# Altium schematic sheet pwir21-NUCLEO-adapter.SchDoc
size A4; SheetNumber: 1; SheetTotal: 1
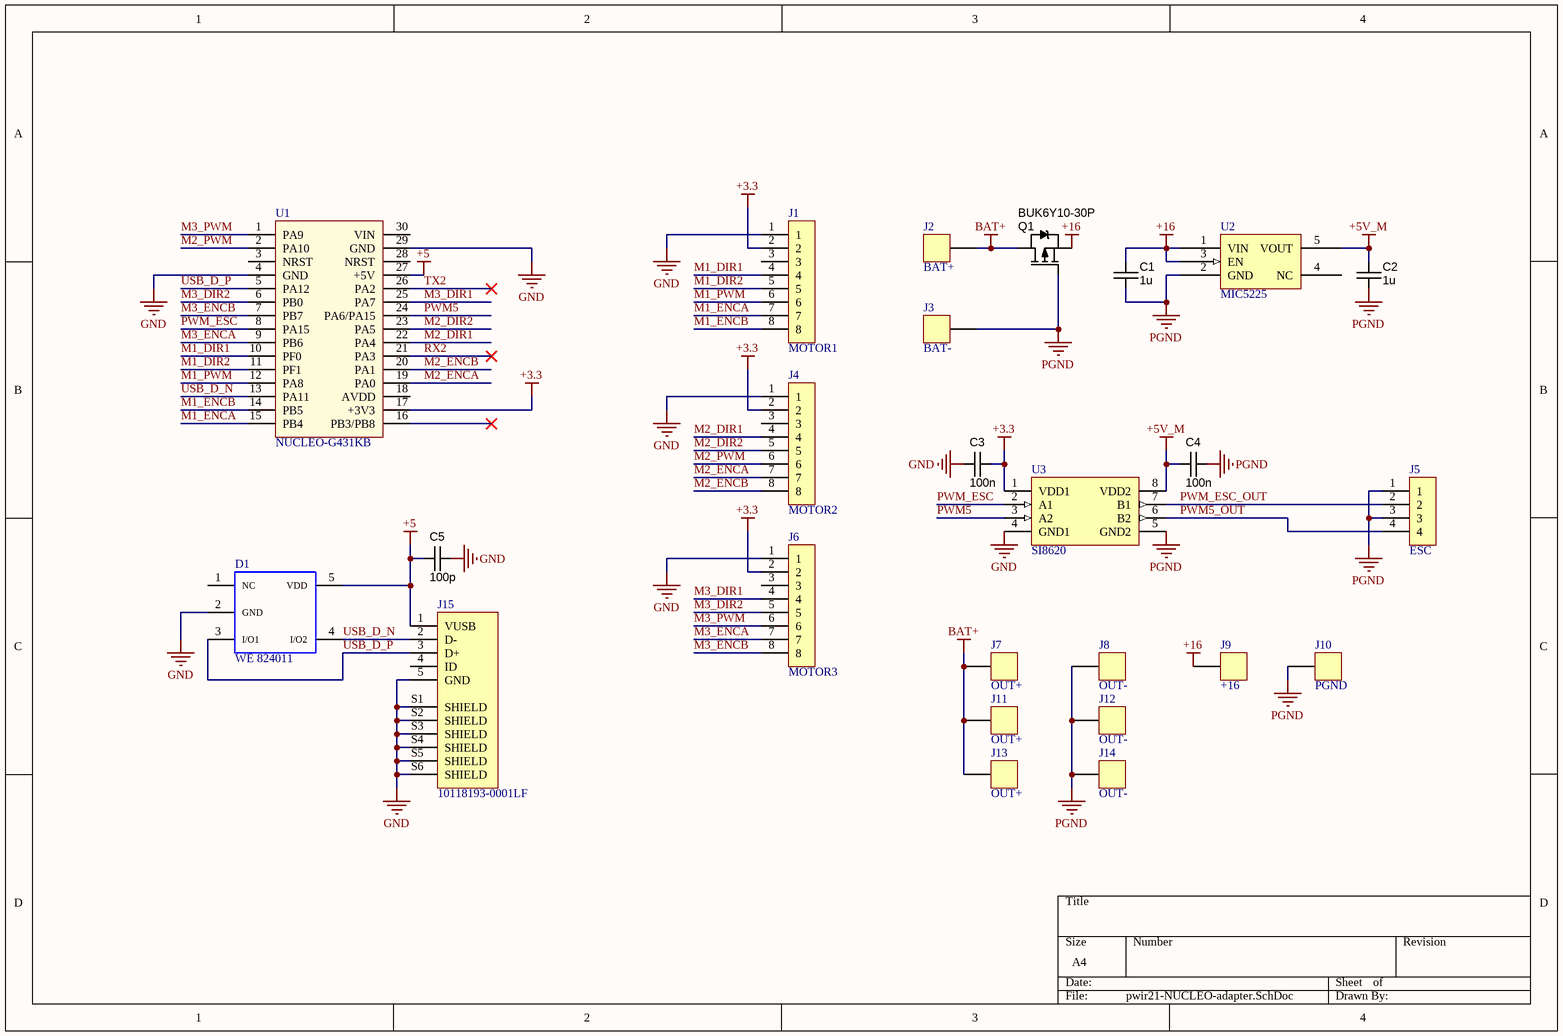
[diagram p0: pwir21-NUCLEO-adapter.SchDoc]

## Parts
C1  value 1u  [CAPC1608X90N]  (hidden comment: approved sub OK)
C2  value 1u  [CAPC1608X90N]  (hidden comment: approved sub OK)
C3  value 100n  [CAPC1608X90N]  (hidden comment: approved sub OK)
C4  value 100n  [CAPC1608X90N]  (hidden comment: approved sub OK)
C5  100p  [CAPC1608X90N]
D1  WE 824011  [WE-TVS_SOT23-5L]
J1  MOTOR1  [MICRO-MATCH-FOB-08]
J2  BAT+  [POWER-PAD-4x3]
J3  BAT-  [POWER-PAD-4x3]
J4  MOTOR2  [MICRO-MATCH-FOB-08]
J5  ESC  [MICRO-MATCH-FOB-04]
J6  MOTOR3  [MICRO-MATCH-FOB-08]
J7  OUT+  [POWER-PAD-4x3]
J8  OUT-  [POWER-PAD-4x3]
J9  +16  [POWER-PAD-4x3]
J10  PGND  [POWER-PAD-4x3]
J11  OUT+  [POWER-PAD-4x3]
J12  OUT-  [POWER-PAD-4x3]
J13  OUT+  [POWER-PAD-4x3]
J14  OUT-  [POWER-PAD-4x3]
J15  10118193-0001LF  [FCI_10118193-0001LF]
Q1  BUK6Y10-30P  [SOT669]
U1  NUCLEO-G431KB  [NUCLEO-32-SMT]
U2  MIC5225  [SOT23-5]
U3  SI8620  [SOIC8]

## Nets
+3.3: C3.2 J1.2 J4.2 J6.2 U1.17(+3V3) U3.1(VDD1)
+5: C5.2 D1.5(VDD) J15.1(VUSB) U1.27(+5V)
+5V_M: C2.1 C4.1 U2.5(VOUT) U3.8(VDD2)
+16: C1.1 J9.1 Q1.S U2.1(VIN) U2.3(EN)
BAT+: J2.1 J7.1 J11.1 J13.1 Q1.D
GND: C3.1 C5.1 D1.2(GND) J1.1 J4.1 J6.1 J15.5(GND) J15.S1(SHIELD) J15.S2(SHIELD) J15.S3(SHIELD) J15.S4(SHIELD) J15.S5(SHIELD) J15.S6(SHIELD) U1.4(GND) U1.29(GND) U3.4(GND1)
PGND: C1.2 C2.2 C4.2 J3.1 J5.1 J5.3 J8.1 J10.1 J12.1 J14.1 Q1.G U2.2(GND) U3.5(GND2)
M1_DIR1: J1.4 U1.10(PF0)
M1_DIR2: J1.5 U1.11(PF1)
M1_ENCA: J1.7 U1.15(PB4)
M1_ENCB: J1.8 U1.14(PB5)
M1_PWM: J1.6 U1.12(PA8)
M2_DIR1: J4.4 U1.22(PA4)
M2_DIR2: J4.5 U1.23(PA5)
M2_ENCA: J4.7 U1.19(PA0)
M2_ENCB: J4.8 U1.20(PA1)
M2_PWM: J4.6 U1.2(PA10)
M3_DIR1: J6.4 U1.25(PA7)
M3_DIR2: J6.5 U1.6(PB0)
M3_ENCA: J6.7 U1.9(PB6)
M3_ENCB: J6.8 U1.7(PB7)
M3_PWM: J6.6 U1.1(PA9)
PWM5: U1.24(PA6/PA15) U3.3(A2)
PWM5_OUT: J5.4 U3.6(B2)
PWM_ESC: U1.8(PA15) U3.2(A1)
PWM_ESC_OUT: J5.2 U3.7(B1)
RX2: U1.21(PA3)
TX2: U1.26(PA2)
USB_D_N: D1.4(I/O2) J15.2(D-) U1.13(PA11)
USB_D_P: D1.3(I/O1) J15.3(D+) U1.5(PA12)

Not connected (* = marked no-connect by the designer): D1 1(NC); J1 3; J4 3; J6 3; J15 4(ID); U1 3(NRST) 16(PB3/PB8)* 18(AVDD) 28(NRST) 30(VIN); U2 4(NC)

## Library data of the parts
C1 C2 = CAPC_1u_0603_X7R_16V_10%: Capacitor SMD Cer 1uF 10% 16V X7R 0603; Manufacturer 1: TDK Corporation; Manufacturer Part Number 1: C1608X7R1C105K; Ratings: 16V; X7R; Material: ceramic; SCDType: spec; Package / Case: 0603 (1608 metric); Tolerance: ±10%; Supplier 1: Digi-Key; Supplier Part Number 1: 445-1604-1-ND; ComponentLink1URL: http://product.tdk.com/capacitor/mlcc/en/documents/mlcc_commercial_general_en.pdf; ComponentLink1Description: http://product.tdk.com/capacitor/mlcc/en/documents/mlcc_commercial_general_en.pdf
C3 C4 = CAPC_100n_0603_X7R_50V_10%: Capacitor SMD Cer 100nF 10% 50V X7R 0603; Manufacturer 1: AVX Corporation; Manufacturer Part Number 1: 06035C104KAT2A; Ratings: 50V; X7R; Material: ceramic; SCDType: spec; Manufacturer 2: TDK Corporation; Manufacturer Part Number 2: C1608X7R1H104K; Package / Case: 0603 (1608 Metric); Tolerance: ±10%; Supplier 1: Digi-Key; Supplier Part Number 1: 478-5052-1-ND; ComponentLink1URL: http://www.avx.com/docs/Catalogs/cx7r.pdf; ComponentLink1Description: http://www.avx.com/docs/Catalogs/cx7r.pdf; Supplier 2: Digi-Key; Supplier Part Number 2: 445-1314-1-ND; ComponentLink2URL: http://product.tdk.com/capacitor/mlcc/en/documents/mlcc_commercial_general_en.pdf; ComponentLink2Description: http://product.tdk.com/capacitor/mlcc/en/documents/mlcc_commercial_general_en.pdf
C5 = CAPC_100p_0603_NP0_50V_1%: Capacitor SMD Cer 100pF 1% 50V NP0 0603; Manufacturer 1: AVX Corporation; Manufacturer Part Number 1: 06035A101FAT2A; Ratings: 50V; NP0; SCDType: source; Operating Temperature: -55°C ~ 125°C; Package / Case: 0603 (1608 Metric); Size / Dimension: 0.063" L x 0.032" W (1.60mm x 0.81mm); Thickness (Max): 0.035" (0.90mm); ComponentLink1URL: http://www.avx.com/docs/Catalogs/ccog.pdf; ComponentLink1Description: http://www.avx.com/docs/Catalogs/ccog.pdf; Supplier 1: Digi-Key; Supplier Part Number 1: 478-6202-1-ND; Supplier 2: Digi-Key; Supplier Part Number 2: 1276-2159-1-ND; Manufacturer 2: Samsung Electro-Mechanics America, Inc; Manufacturer Part Number 2: CL10C101FB8NNNC; RoHS 2: RoHS Compliant; ComponentLink2URL: http://www.samsungsem.com/servlet/FileDownload?type=spec&file=CL10C101FB8NNNC.pdf; ComponentLink2Description: http://www.samsungsem.com/servlet/FileDownload?type=spec&file=CL10C101FB8NNNC.pdf; RoHS 1: RoHS Compliant; Supplier 3: Digi-Key; Supplier Part Number 3: 399-7819-1-ND; Manufacturer 3: Kemet; Manufacturer Part Number 3: C0603C101F5GACTU; RoHS 3: RoHS Compliant; ComponentLink3URL: http://www.kemet.com/datasheets&C0603C101F5GACTU; ComponentLink3Description: http://www.kemet.com/datasheets&C0603C101F5GACTU; Tolerance: ±1%; Value: 100p
D1 = 824011: WE-TVS TVS Diode - High Speed Series, SOT23-5L, 2+1Channel, 5Vdc; Manufacturer: Wurth Elektronik; Reverse Breakdown Voltage min.: 6.1V; Channel: 2+1; Channel Input Capacitance: 2pF; Reverse Peak Pulse Current: 12A; Reverse Channel Leakage Current: 5uA; DC Operating Voltage: 5V; ComponentLink1Description: Manufacturer; ComponentLink1URL: http://www.we-online.de; ComponentLink2Description: Datasheet; ComponentLink2URL: https://www.we-online.com/catalog/datasheet/824011.pdf; Manufacturer Part Number: 824011; Published Date: April 2020; Size: SOT23-5L; Operating Temperature: -55 to +125degC; Mounting Technology: SMT; Packaging: Tape and Reel
J1 J4 J6 = HEADER-8
J2 J3 J7-J14 = HEADER-1
J5 = HEADER-4
J15 = 10118193-0001LF: USB - micro B USB 2.0 Receptacle Connector 5 Position Surface Mount, Right Angle; Through Hole; MF: Amphenol ICC; Availability: Unavailable; SnapEDA_Link: https://www.snapeda.com/parts/10118193-0001LF/Amphenol%20FCI/view-part/2758989/?ref=snap; MP: 10118193-0001LF; Price: None; Value: *; Package: None
Q1 = MOSFET-P
U2 = LDO-SOT23-5